# Altium schematic sheet BM1370.SchDoc
size A3; SheetNumber: 4; SheetTotal: 16
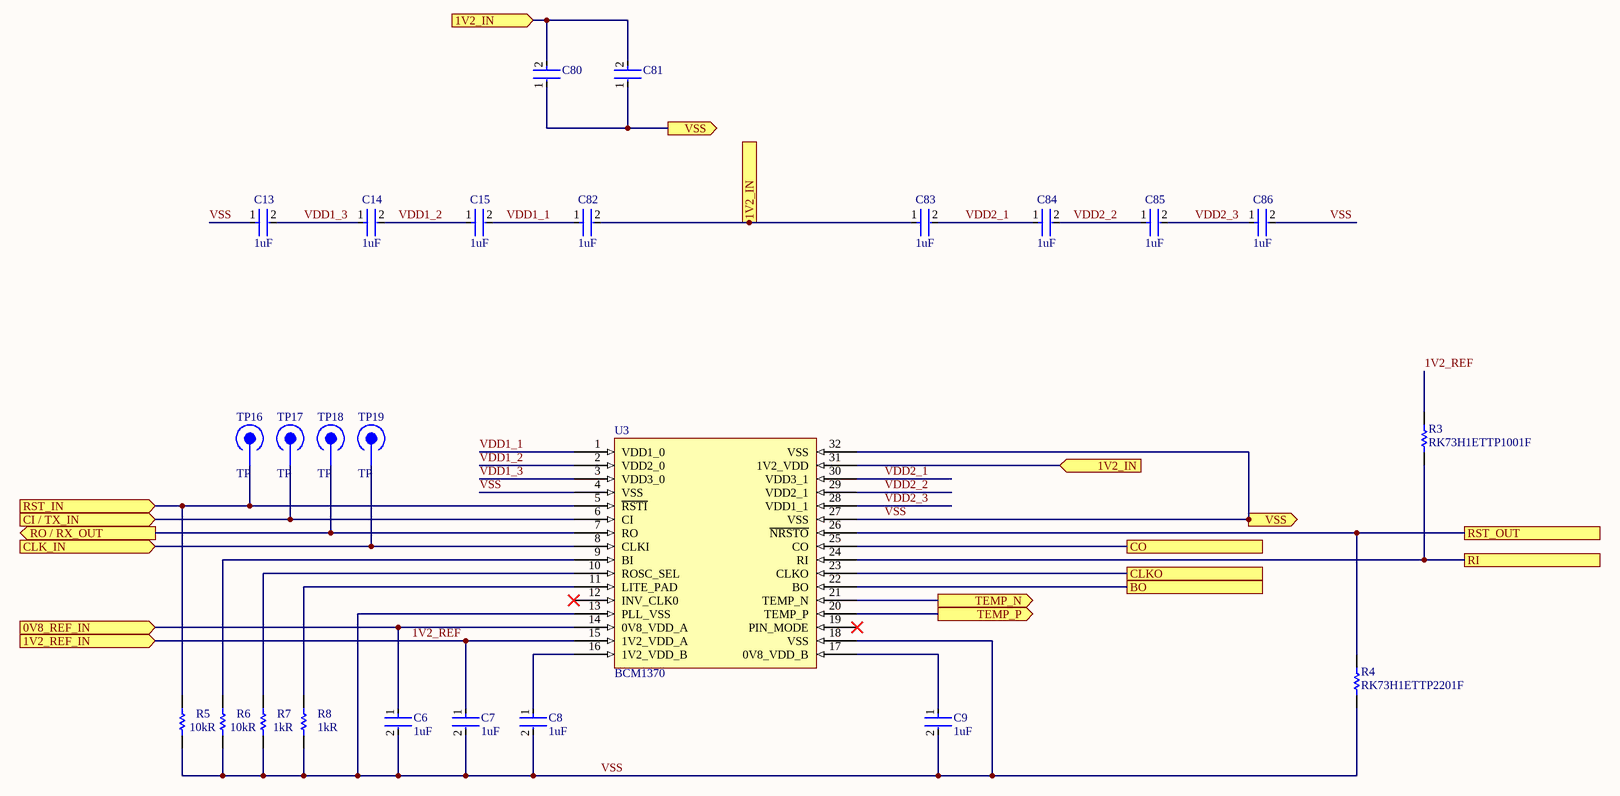
[diagram p0: BM1370.SchDoc]

## Parts
C6  value 1uF  [FP-0402-L_1_0_0_05-W_0_5-MFG]  (hidden comment: EMK105BJ105KV-F)
C7  value 1uF  [FP-0402-L_1_0_0_05-W_0_5-MFG]  (hidden comment: EMK105BJ105KV-F)
C8  value 1uF  [FP-0402-L_1_0_0_05-W_0_5-MFG]  (hidden comment: EMK105BJ105KV-F)
C9  value 1uF  [FP-0402-L_1_0_0_05-W_0_5-MFG]  (hidden comment: EMK105BJ105KV-F)
C13  value 1uF  [FP-0402-L_1_0_0_05-W_0_5-MFG]  (hidden comment: EMK105BJ105KV-F)
C14  value 1uF  [FP-0402-L_1_0_0_05-W_0_5-MFG]  (hidden comment: EMK105BJ105KV-F)
C15  value 1uF  [FP-0402-L_1_0_0_05-W_0_5-MFG]  (hidden comment: EMK105BJ105KV-F)
C80  GRM31CR60J107MEA8K  [FP-GRM31C-0_3-e0_3_0_8-IPC_A]  (value not drawn)
C81  GRM31CR60J107MEA8K  [FP-GRM31C-0_3-e0_3_0_8-IPC_A]  (value not drawn)
C82  value 1uF  [FP-0402-L_1_0_0_05-W_0_5-MFG]  (hidden comment: EMK105BJ105KV-F)
C83  value 1uF  [FP-0402-L_1_0_0_05-W_0_5-MFG]  (hidden comment: EMK105BJ105KV-F)
C84  value 1uF  [FP-0402-L_1_0_0_05-W_0_5-MFG]  (hidden comment: EMK105BJ105KV-F)
C85  value 1uF  [FP-0402-L_1_0_0_05-W_0_5-MFG]  (hidden comment: EMK105BJ105KV-F)
C86  value 1uF  [FP-0402-L_1_0_0_05-W_0_5-MFG]  (hidden comment: EMK105BJ105KV-F)
R3  RK73H1ETTP1001F  [RESC1005X40X25LL10T10]
R4  RK73H1ETTP2201F  [RK73H1ETTP2201F-Footprint-1]
R5  value 10kR  [RESC1005X40X25LL10T10]  (hidden comment: RK73H1ETTP1002F)
R6  value 10kR  [RESC1005X40X25LL10T10]  (hidden comment: RK73H1ETTP1002F)
R7  value 1kR  [RESC1005X40X25LL10T10]  (hidden comment: RK73H1ETTP1001F)
R8  value 1kR  [RESC1005X40X25LL10T10]  (hidden comment: RK73H1ETTP1001F)
TP16  TP  [TP-Footprint-1]
TP17  TP  [TP-Footprint-1]
TP18  TP  [TP-Footprint-1]
TP19  TP  [TP-Footprint-1]
U3  BCM1370  [BCM1370-Footprint-1]

## Ports
0V8_REF_IN (in), 1V2_IN (in), 1V2_REF_IN (in), BO, CI / TX_IN (in), CLK_IN (in), CLKO, CO, RI, RO / RX_OUT (out), RST_IN (in), RST_OUT, TEMP_N (out), TEMP_P (out), VSS (out)

## Nets
0V8_REF_IN: C6.1 U3.14(0V8_VDD_A) ; port 0V8_REF_IN
1V2_IN: C80.2 C81.2 C82.2 C83.1 U3.31(1V2_VDD) ; port 1V2_IN
1V2_REF: C7.1 R3.2 U3.15(1V2_VDD_A) ; port 1V2_REF_IN
BO: U3.22(BO) ; port BO
CI / TX_IN: TP17.1 U3.6(CI) ; port CI / TX_IN
CLK_IN: TP19.1 U3.8(CLKI) ; port CLK_IN
CLKO: U3.23(CLKO) ; port CLKO
CO: U3.25(CO) ; port CO
RI: R3.1 U3.24(RI) ; port RI
RO / RX_OUT: TP18.1 U3.7(RO) ; port RO / RX_OUT
RST_IN: R5.2 TP16.1 U3.5(~{RSTI}) ; port RST_IN
RST_OUT: R4.2 U3.26(~{NRSTO}) ; port RST_OUT
TEMP_N: U3.21(TEMP_N) ; port TEMP_N
TEMP_P: U3.20(TEMP_P) ; port TEMP_P
VDD1_1: C15.2 C82.1 U3.1(VDD1_0)
VDD1_2: C14.2 C15.1 U3.2(VDD2_0)
VDD1_3: C13.2 C14.1 U3.3(VDD3_0)
VDD2_1: C83.2 C84.1 U3.30(VDD3_1)
VDD2_2: C84.2 C85.1 U3.29(VDD2_1)
VDD2_3: C85.2 C86.1 U3.28(VDD1_1)
VSS: C6.2 C7.2 C8.2 C9.2 C13.1 C80.1 C81.1 C86.2 R4.1 R5.1 R6.1 R7.1 R8.1 U3.4(VSS) U3.13(PLL_VSS) U3.18(VSS) U3.27(VSS) U3.32(VSS) ; port VSS
NetC8_1: C8.1 U3.16(1V2_VDD_B)
NetC9_1: C9.1 U3.17(0V8_VDD_B)
NetR6_2: R6.2 U3.9(BI)
NetR7_2: R7.2 U3.10(ROSC_SEL)
NetR8_2: R8.2 U3.11(LITE_PAD)

Not connected (* = marked no-connect by the designer): U3 12(INV_CLK0)* 19(PIN_MODE)*

## Library data of the parts
C6-C9 C13-C15 C82-C86 = CMP-x00039-4: Ceramic Capacitor, Multilayer, Ceramic, 16V, 10% +Tol, 10% -Tol, X5R, 15% TC, 1uF, Surface Mount, 0402; Manufacturer: Taiyo Yuden; Vendor: TTI; Template: TY_0402; Reel Width: 8mm; Mounting: SMT; Category: Capacitors; MOQ: 10000; Price: 0.000718; Rating: 16V; Package: 0402
C80 C81 = CMP-x00203-1: Ceramic Capacitor, Multilayer, Ceramic, 6.3V, 20% +Tol, 20% -Tol, X5R, 15% TC, 100uF, Surface Mount, 1206; Manufacturer: Murata; Template: MR_1206_C; Package: 1206; Mounting: SMD; Category: Capacitors
R3 = CMP-x00163-1: Fixed Resistor, Metal Glaze/thick Film, 0.1W, 1000ohm, 75V, 1% +/-Tol, 100ppm/Cel, Surface Mount, 0402; Value: 1kR
R4 = CMP-x00008-3: Fixed Resistor, Metal Glaze/thick Film, 0.1W, 2200ohm, 75V, 1% +/-Tol, 100ppm/Cel, Surface Mount, 0402; Manufacturer: KOA Speer; Value: 2.2kΩ; Reel Width: 8mm; Rating: 100mW; Template: KS_0402; Vendor: TTI; Package: 0402; Category: Resistor; Price: 0.00297; MOQ: 10000; Mounting: SMT
R5 R6 = CMP-x00150-1: Fixed Resistor, Metal Glaze/thick Film, 0.1W, 10000ohm, 75V, 1% +/-Tol, 100ppm/Cel, Surface Mount, 0402
R7 R8 = CMP-x00163-1: Fixed Resistor, Metal Glaze/thick Film, 0.1W, 1000ohm, 75V, 1% +/-Tol, 100ppm/Cel, Surface Mount, 0402
TP16-TP19 = CMP-001-0086-3: digital shovel test point
U3 = CMP-x00104-5: BCM1370 Miner Chip; Manufacturer: Bitmain; Template: BM_QFN32; Vendor: -; Reel Width: -; Mounting: SMT; Value: -; Package: QFN32; Category: Integrated Circuit; MOQ: -; Price: -